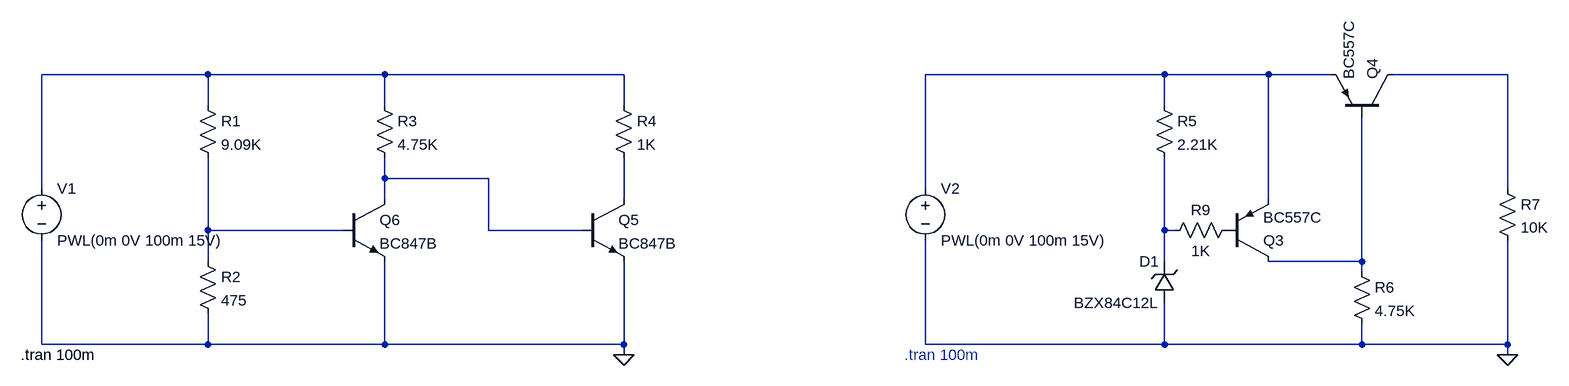
[diagram p0: schematic Task_2.asc]
Task_2.asc, the LTspice schematic file:
Version 4.1
SHEET 1 2148 680
WIRE 80 16 -176 16
WIRE 352 16 80 16
WIRE 720 16 352 16
WIRE 1552 16 1184 16
WIRE 1712 16 1552 16
WIRE 1808 16 1712 16
WIRE 2080 16 1904 16
WIRE 80 64 80 16
WIRE 352 64 352 16
WIRE 720 64 720 16
WIRE 1552 64 1552 16
WIRE 352 176 352 144
WIRE 512 176 352 176
WIRE -176 192 -176 16
WIRE 1184 192 1184 16
WIRE 2080 192 2080 16
WIRE 352 208 352 176
WIRE 720 208 720 144
WIRE 1712 208 1712 16
WIRE 80 256 80 144
WIRE 288 256 80 256
WIRE 512 256 512 176
WIRE 656 256 512 256
WIRE 1552 256 1552 144
WIRE 1568 256 1552 256
WIRE 80 304 80 256
WIRE 1552 304 1552 256
WIRE 1856 304 1856 80
WIRE 1856 304 1712 304
WIRE 1856 320 1856 304
WIRE -176 432 -176 272
WIRE 80 432 80 384
WIRE 80 432 -176 432
WIRE 352 432 352 304
WIRE 352 432 80 432
WIRE 720 432 720 304
WIRE 720 432 352 432
WIRE 1184 432 1184 272
WIRE 1552 432 1552 368
WIRE 1552 432 1184 432
WIRE 1856 432 1856 400
WIRE 1856 432 1552 432
WIRE 2080 432 2080 272
WIRE 2080 432 1856 432
WIRE 720 448 720 432
WIRE 2080 448 2080 432
FLAG 720 448 0
FLAG 2080 448 0
SYMBOL res 64 48 R0
SYMATTR InstName R1
SYMATTR Value 9.09K
SYMATTR SpiceLine tol=1 pwr=0.1
SYMBOL res 64 288 R0
SYMATTR InstName R2
SYMATTR Value 475
SYMATTR SpiceLine tol=1 pwr=0.1
SYMBOL res 336 48 R0
SYMATTR InstName R3
SYMATTR Value 4.75K
SYMATTR SpiceLine tol=1 pwr=0.1
SYMBOL res 704 48 R0
SYMATTR InstName R4
SYMATTR Value 1K
SYMATTR SpiceLine tol=1 pwr=0.1
SYMBOL voltage -176 176 R0
WINDOW 123 0 0 Left 0
WINDOW 39 0 0 Left 0
SYMATTR InstName V1
SYMATTR Value PWL(0m 0V 100m 15V)
SYMBOL res 1536 48 R0
SYMATTR InstName R5
SYMATTR Value 2.21K
SYMATTR SpiceLine tol=1 pwr=0.1
SYMBOL voltage 1184 176 R0
WINDOW 123 0 0 Left 0
WINDOW 39 0 0 Left 0
SYMATTR InstName V2
SYMATTR Value PWL(0m 0V 100m 15V)
SYMBOL res 1664 240 R90
WINDOW 0 0 56 VBottom 2
WINDOW 3 32 56 VTop 2
SYMATTR InstName R9
SYMATTR Value 1K
SYMATTR SpiceLine tol=1 pwr=0.1
SYMBOL zener 1568 368 R180
WINDOW 0 24 64 Left 2
WINDOW 3 24 0 Left 2
SYMATTR InstName D1
SYMATTR Value BZX84C12L
SYMBOL pnp 1904 80 M270
SYMATTR InstName Q4
SYMATTR Value BC557C
SYMBOL pnp 1648 304 M180
SYMATTR InstName Q3
SYMATTR Value BC557C
SYMBOL res 1840 304 R0
SYMATTR InstName R6
SYMATTR Value 4.75K
SYMATTR SpiceLine tol=1 pwr=0.1
SYMBOL res 2064 176 R0
SYMATTR InstName R7
SYMATTR Value 10K
SYMATTR SpiceLine tol=1 pwr=0.1
SYMBOL npn3 656 208 R0
SYMATTR InstName Q5
SYMATTR Value BC847B
SYMBOL npn3 288 208 R0
SYMATTR InstName Q6
SYMATTR Value BC847B
TEXT -208 448 Left 2 !.tran 100m
TEXT 1152 448 Left 2 ;.tran 100m

The netlist it stands for:
* Task_2.asc
R1 N001 N006 9.09K tol=1 pwr=0.1
R2 N006 0 475 tol=1 pwr=0.1
R3 N001 N004 4.75K tol=1 pwr=0.1
R4 N001 N005 1K tol=1 pwr=0.1
V1 N001 0 PWL(0m 0V 100m 15V)
R5 N002 N007 2.21K tol=1 pwr=0.1
V2 N002 0 PWL(0m 0V 100m 15V)
R9 P001 N007 1K tol=1 pwr=0.1
D1 0 N007 BZX84C12L
Q4 N003 N008 N002 0 BC557C
Q3 N008 P001 N002 0 BC557C
R6 N008 0 4.75K tol=1 pwr=0.1
R7 N003 0 10K tol=1 pwr=0.1
Q5 N005 N004 0 0 BC847B
Q6 N004 N006 0 0 BC847B
.model D D
.lib standard.dio
.model NPN NPN
.model PNP PNP
.lib standard.bjt
.tran 100m
* .tran 100m
.backanno
.end